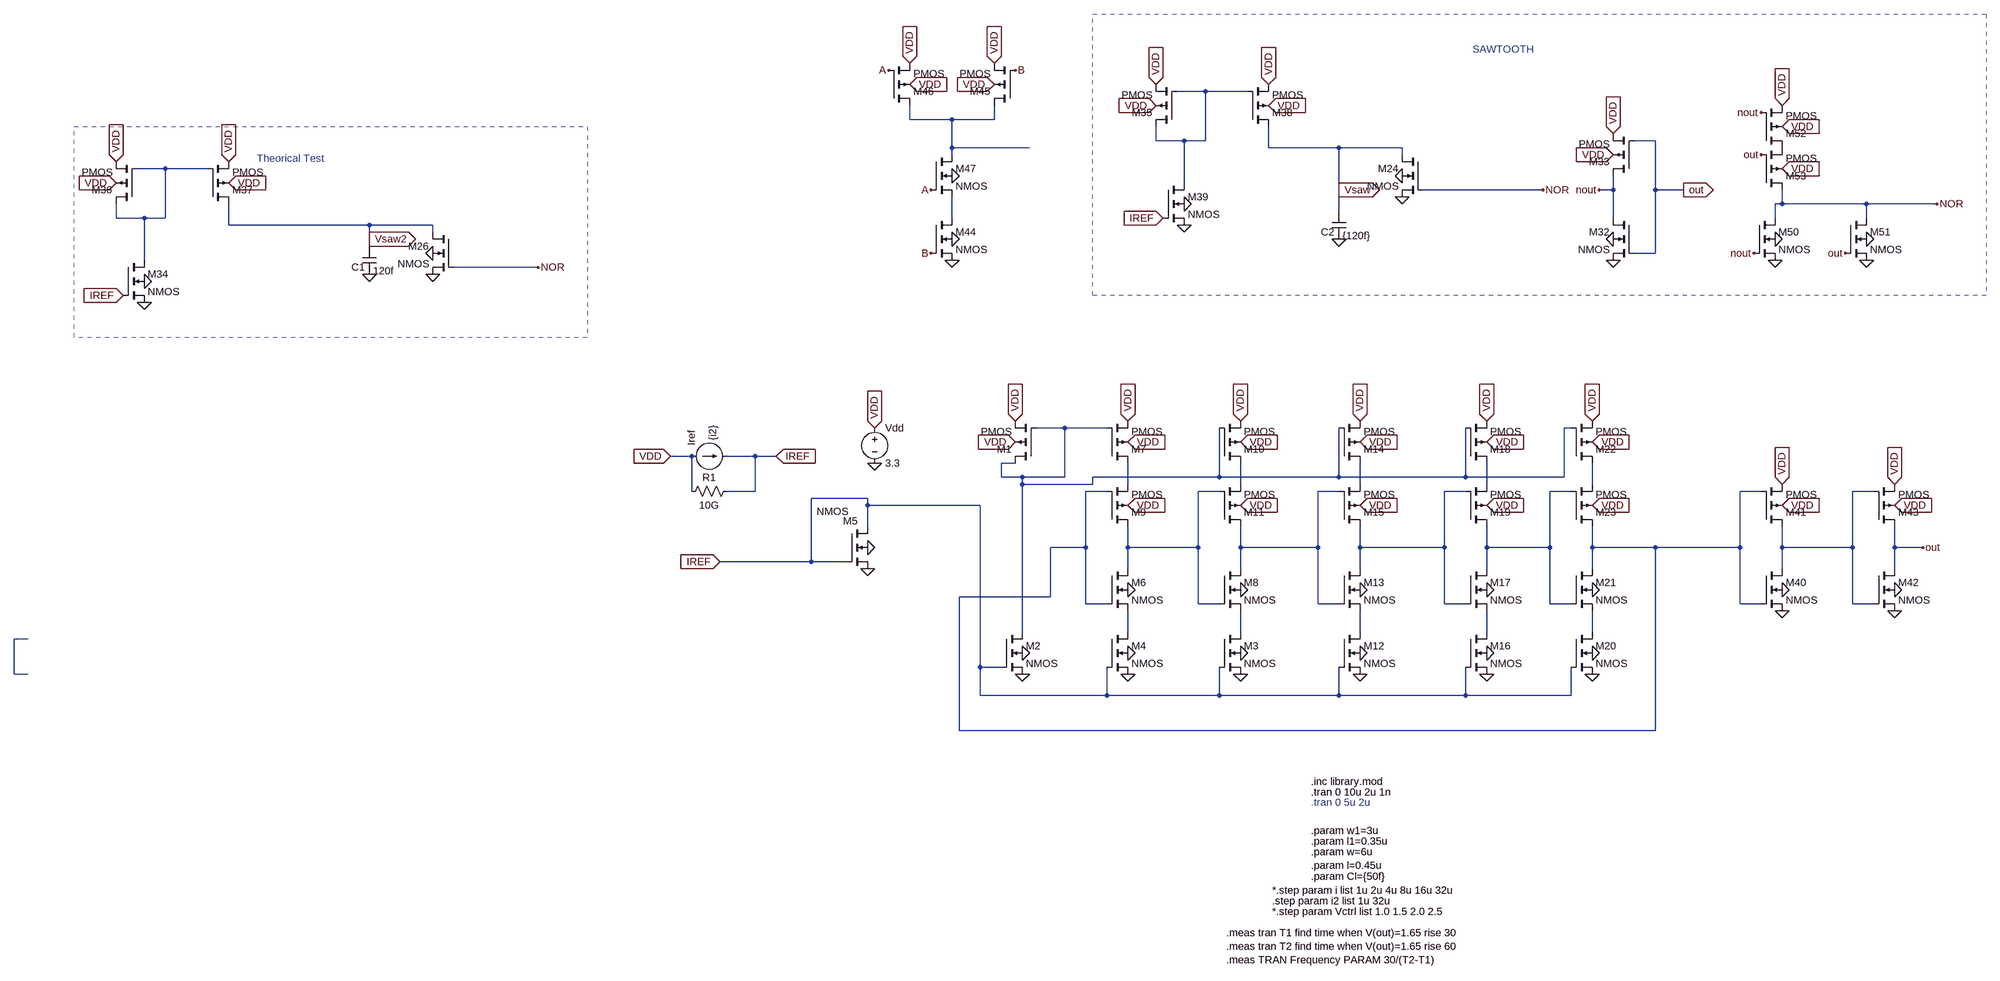
[diagram p0: schematic sawtooth.asc]
sawtooth.asc, the LTspice schematic file:
Version 4
SHEET 1 2660 1612
WIRE 272 -880 208 -880
WIRE 368 -880 272 -880
WIRE -400 -816 -400 -848
WIRE -304 -816 -400 -816
WIRE -208 -816 -208 -848
WIRE -208 -816 -304 -816
WIRE 160 -768 160 -800
WIRE 224 -768 160 -768
WIRE 272 -768 272 -880
WIRE 272 -768 224 -768
WIRE 1296 -768 1248 -768
WIRE -304 -752 -304 -816
WIRE -128 -752 -304 -752
WIRE 416 -752 416 -800
WIRE 576 -752 416 -752
WIRE 720 -752 576 -752
WIRE -304 -736 -304 -752
WIRE 720 -736 720 -752
WIRE -2480 -704 -2544 -704
WIRE -2384 -704 -2480 -704
WIRE 224 -672 224 -768
WIRE 576 -656 576 -752
WIRE 1040 -656 768 -656
WIRE 1200 -656 1200 -688
WIRE 1200 -656 1168 -656
WIRE 1296 -656 1296 -768
WIRE 1360 -656 1296 -656
WIRE 1584 -624 1584 -656
WIRE 1584 -624 1568 -624
WIRE 1776 -624 1584 -624
WIRE 1936 -624 1776 -624
WIRE 576 -608 576 -656
WIRE -2592 -592 -2592 -624
WIRE -2528 -592 -2592 -592
WIRE -2480 -592 -2480 -704
WIRE -2480 -592 -2528 -592
WIRE -304 -592 -304 -640
WIRE 1200 -592 1200 -656
WIRE 1568 -592 1568 -624
WIRE 1776 -592 1776 -624
WIRE -2336 -576 -2336 -624
WIRE -2016 -576 -2336 -576
WIRE -1872 -576 -2016 -576
WIRE -1872 -560 -1872 -576
WIRE -2016 -544 -2016 -576
WIRE -2016 -528 -2016 -544
WIRE 1296 -512 1296 -656
WIRE 1296 -512 1248 -512
WIRE -2528 -496 -2528 -592
WIRE -1632 -480 -1824 -480
WIRE -48 -96 -112 -96
WIRE 48 -96 -48 -96
WIRE 1104 -96 1088 -96
WIRE -896 -32 -944 -32
WIRE -752 -32 -816 -32
WIRE -704 -32 -752 -32
WIRE -160 -16 -192 -16
WIRE -192 16 -192 -16
WIRE -144 16 -192 16
WIRE -48 16 -48 -96
WIRE -48 16 -144 16
WIRE 304 16 304 -96
WIRE 304 16 16 16
WIRE 576 16 576 -96
WIRE 576 16 304 16
WIRE 864 16 864 -96
WIRE 864 16 576 16
WIRE 1088 16 1088 -96
WIRE 1088 16 864 16
WIRE -144 32 -144 16
WIRE 16 32 16 16
WIRE 16 32 -144 32
WIRE 96 32 96 -16
WIRE 352 32 352 -16
WIRE 624 32 624 -16
WIRE 912 32 912 -16
WIRE 1152 32 1152 -16
WIRE -896 48 -896 -32
WIRE -752 48 -752 -32
WIRE -752 48 -816 48
WIRE 48 48 0 48
WIRE 304 48 256 48
WIRE 576 48 528 48
WIRE 864 48 816 48
WIRE 1104 48 1056 48
WIRE 1536 48 1488 48
WIRE 1792 48 1744 48
WIRE -496 64 -624 64
WIRE -496 80 -496 64
WIRE -240 80 -496 80
WIRE -496 128 -496 80
WIRE 0 176 0 48
WIRE 0 176 -80 176
WIRE 96 176 96 128
WIRE 256 176 256 48
WIRE 256 176 96 176
WIRE 352 176 352 128
WIRE 528 176 528 48
WIRE 528 176 352 176
WIRE 624 176 624 128
WIRE 816 176 816 48
WIRE 816 176 624 176
WIRE 912 176 912 128
WIRE 1056 176 1056 48
WIRE 1056 176 912 176
WIRE 1152 176 1152 128
WIRE 1296 176 1152 176
WIRE 1488 176 1488 48
WIRE 1488 176 1296 176
WIRE 1584 176 1584 128
WIRE 1744 176 1744 48
WIRE 1744 176 1584 176
WIRE 1840 176 1840 128
WIRE 1904 176 1840 176
WIRE -624 208 -624 64
WIRE -624 208 -832 208
WIRE -544 208 -624 208
WIRE 96 224 96 176
WIRE 352 224 352 176
WIRE 624 224 624 176
WIRE 912 224 912 176
WIRE 1152 224 1152 176
WIRE 1584 224 1584 176
WIRE 1840 224 1840 176
WIRE -80 288 -80 176
WIRE -80 288 -288 288
WIRE 0 304 0 176
WIRE 48 304 0 304
WIRE 256 304 256 176
WIRE 304 304 256 304
WIRE 528 304 528 176
WIRE 576 304 528 304
WIRE 816 304 816 176
WIRE 864 304 816 304
WIRE 1056 304 1056 176
WIRE 1104 304 1056 304
WIRE 1488 304 1488 176
WIRE 1536 304 1488 304
WIRE 1744 304 1744 176
WIRE 1792 304 1744 304
WIRE -144 368 -144 32
WIRE 96 368 96 320
WIRE 352 368 352 320
WIRE 624 368 624 320
WIRE 912 368 912 320
WIRE 1152 368 1152 320
WIRE -3824 384 -3856 384
WIRE -240 448 -240 80
WIRE -192 448 -240 448
WIRE -3856 464 -3856 384
WIRE -3824 464 -3856 464
WIRE -240 512 -240 448
WIRE 48 512 48 448
WIRE 48 512 -240 512
WIRE 304 512 304 448
WIRE 304 512 48 512
WIRE 576 512 576 448
WIRE 576 512 304 512
WIRE 864 512 864 448
WIRE 864 512 576 512
WIRE 1104 512 1104 448
WIRE 1104 512 864 512
WIRE -288 592 -288 288
WIRE 1296 592 1296 176
WIRE 1296 592 -288 592
FLAG -480 -96 VDD
IOPIN -480 -96 In
FLAG -480 -16 0
FLAG -160 -112 VDD
IOPIN -160 -112 In
FLAG -160 -64 VDD
IOPIN -160 -64 In
FLAG -144 416 0
FLAG -144 464 0
FLAG 96 416 0
FLAG 96 464 0
FLAG -496 176 0
FLAG 96 272 0
FLAG 96 -112 VDD
IOPIN 96 -112 In
FLAG 96 -64 VDD
IOPIN 96 -64 In
FLAG 96 80 VDD
IOPIN 96 80 In
FLAG 352 416 0
FLAG 352 464 0
FLAG 352 272 0
FLAG 352 -112 VDD
IOPIN 352 -112 In
FLAG 352 -64 VDD
IOPIN 352 -64 In
FLAG 352 80 VDD
IOPIN 352 80 In
FLAG 624 416 0
FLAG 624 464 0
FLAG 624 272 0
FLAG 624 -112 VDD
IOPIN 624 -112 In
FLAG 624 -64 VDD
IOPIN 624 -64 In
FLAG 624 80 VDD
IOPIN 624 80 In
FLAG 912 416 0
FLAG 912 464 0
FLAG 912 272 0
FLAG 912 -112 VDD
IOPIN 912 -112 In
FLAG 912 -64 VDD
IOPIN 912 -64 In
FLAG 912 80 VDD
IOPIN 912 80 In
FLAG 1152 416 0
FLAG 1152 464 0
FLAG 1152 272 0
FLAG 1152 -112 VDD
IOPIN 1152 -112 In
FLAG 1152 -64 VDD
IOPIN 1152 -64 In
FLAG 1152 80 VDD
IOPIN 1152 80 In
FLAG -496 224 0
FLAG 576 -544 0
FLAG 720 -688 0
FLAG 720 -640 0
FLAG 576 -656 Vsaw
IOPIN 576 -656 Out
FLAG -2016 -464 0
FLAG -1872 -512 0
FLAG -1872 -464 0
FLAG -2016 -544 Vsaw2
IOPIN -2016 -544 Out
FLAG -832 208 IREF
IOPIN -832 208 In
FLAG -704 -32 IREF
IOPIN -704 -32 In
FLAG 1200 -544 0
FLAG 1200 -736 VDD
IOPIN 1200 -736 In
FLAG 1200 -784 VDD
IOPIN 1200 -784 In
FLAG 1200 -496 0
FLAG -2592 -720 VDD
IOPIN -2592 -720 In
FLAG -2592 -672 VDD
IOPIN -2592 -672 In
FLAG -2336 -720 VDD
IOPIN -2336 -720 In
FLAG -2336 -672 VDD
IOPIN -2336 -672 In
FLAG -2528 -448 0
FLAG -2528 -400 0
FLAG -2576 -416 IREF
IOPIN -2576 -416 In
FLAG 160 -896 VDD
IOPIN 160 -896 In
FLAG 160 -848 VDD
IOPIN 160 -848 In
FLAG 416 -896 VDD
IOPIN 416 -896 In
FLAG 416 -848 VDD
IOPIN 416 -848 In
FLAG 224 -624 0
FLAG 224 -576 0
FLAG 176 -592 IREF
IOPIN 176 -592 In
FLAG 1360 -656 out
IOPIN 1360 -656 Out
FLAG 1584 272 0
FLAG 1584 80 VDD
IOPIN 1584 80 In
FLAG 1584 32 VDD
IOPIN 1584 32 In
FLAG 1584 320 0
FLAG 1840 272 0
FLAG 1840 80 VDD
IOPIN 1840 80 In
FLAG 1840 32 VDD
IOPIN 1840 32 In
FLAG 1840 320 0
FLAG 1904 176 out
FLAG -944 -32 VDD
IOPIN -944 -32 In
FLAG -208 -944 VDD
IOPIN -208 -944 In
FLAG -208 -896 VDD
IOPIN -208 -896 In
FLAG -304 -544 0
FLAG -304 -496 0
FLAG -400 -944 VDD
IOPIN -400 -944 In
FLAG -400 -896 VDD
IOPIN -400 -896 In
FLAG -304 -688 0
FLAG -160 -928 B
FLAG -352 -512 B
FLAG -352 -656 A
FLAG 1568 -544 0
FLAG 1568 -496 0
FLAG 1776 -544 0
FLAG 1776 -496 0
FLAG 1584 -848 VDD
IOPIN 1584 -848 In
FLAG 1584 -800 VDD
IOPIN 1584 -800 In
FLAG 1584 -704 VDD
IOPIN 1584 -704 In
FLAG 1536 -832 nout
FLAG 1520 -512 nout
FLAG 1936 -624 NOR
FLAG 1536 -736 out
FLAG 1728 -512 out
FLAG 1168 -656 nout
FLAG 1040 -656 NOR
FLAG -448 -928 A
FLAG -1632 -480 NOR
SYMBOL pmos4 -112 -16 R180
SYMATTR InstName M1
SYMATTR Value2 l=l1 w=w1
SYMBOL voltage -480 -112 R0
SYMATTR InstName Vdd
SYMATTR Value 3.3
SYMBOL current -896 -32 R270
WINDOW 3 35 48 Left 2
WINDOW 123 0 0 Left 0
WINDOW 39 0 0 Left 0
SYMATTR Value {i2}
SYMATTR InstName Iref
SYMBOL nmos4 -192 368 R0
SYMATTR InstName M2
SYMATTR Value2 l=l1 w=w1
SYMBOL res -800 32 R90
WINDOW 0 0 56 VBottom 2
WINDOW 3 32 56 VTop 2
SYMATTR InstName R1
SYMATTR Value 10G
SYMBOL nmos4 48 368 R0
SYMATTR InstName M4
SYMATTR Value2 l=l w=w
SYMBOL nmos4 -544 128 R0
WINDOW 0 -8 -12 Left 2
WINDOW 3 -68 -34 Left 2
SYMATTR InstName M5
SYMATTR Value2 l=0.35u w=3u
SYMBOL nmos4 48 224 R0
SYMATTR InstName M6
SYMATTR Value2 l=l w=w
SYMBOL pmos4 48 -16 M180
SYMATTR InstName M7
SYMATTR Value2 l=l w=w
SYMBOL pmos4 48 128 M180
SYMATTR InstName M9
SYMATTR Value2 l=l w=w
SYMBOL nmos4 304 368 R0
SYMATTR InstName M3
SYMATTR Value2 l=l w=w
SYMBOL nmos4 304 224 R0
SYMATTR InstName M8
SYMATTR Value2 l=l w=w
SYMBOL pmos4 304 -16 M180
SYMATTR InstName M10
SYMATTR Value2 l=l w=w
SYMBOL pmos4 304 128 M180
SYMATTR InstName M11
SYMATTR Value2 l=l w=w
SYMBOL nmos4 576 368 R0
SYMATTR InstName M12
SYMATTR Value2 l=l w=w
SYMBOL nmos4 576 224 R0
SYMATTR InstName M13
SYMATTR Value2 l=l w=w
SYMBOL pmos4 576 -16 M180
SYMATTR InstName M14
SYMATTR Value2 l=l w=w
SYMBOL pmos4 576 128 M180
SYMATTR InstName M15
SYMATTR Value2 l=l w=w
SYMBOL nmos4 864 368 R0
SYMATTR InstName M16
SYMATTR Value2 l=l w=w
SYMBOL nmos4 864 224 R0
SYMATTR InstName M17
SYMATTR Value2 l=l w=w
SYMBOL pmos4 864 -16 M180
SYMATTR InstName M18
SYMATTR Value2 l=l w=w
SYMBOL pmos4 864 128 M180
SYMATTR InstName M19
SYMATTR Value2 l=l w=w
SYMBOL nmos4 1104 368 R0
SYMATTR InstName M20
SYMATTR Value2 l=l w=w
SYMBOL nmos4 1104 224 R0
SYMATTR InstName M21
SYMATTR Value2 l=l w=w
SYMBOL pmos4 1104 -16 M180
SYMATTR InstName M22
SYMATTR Value2 l=l w=w
SYMBOL pmos4 1104 128 M180
SYMATTR InstName M23
SYMATTR Value2 l=l w=w
SYMBOL cap 560 -608 R0
WINDOW 0 -25 48 Left 2
SYMATTR InstName C2
SYMATTR Value {120f}
SYMBOL nmos4 768 -736 M0
SYMATTR InstName M24
SYMATTR Value2 l=0.35u w=4u
SYMBOL cap -2032 -528 R0
WINDOW 0 -25 48 Left 2
SYMATTR InstName C1
SYMATTR Value 120f
SYMBOL nmos4 -1824 -560 M0
SYMATTR InstName M26
SYMATTR Value2 l=0.35u w=2u
SYMBOL nmos4 1248 -592 M0
SYMATTR InstName M32
SYMATTR Value2 l=l w=w
SYMBOL pmos4 1248 -688 R180
SYMATTR InstName M33
SYMATTR Value2 l=l w=w
SYMBOL pmos4 -2544 -624 R180
SYMATTR InstName M36
SYMATTR Value2 l=0.35u w={2u}
SYMBOL pmos4 -2384 -624 M180
SYMATTR InstName M37
SYMATTR Value2 l=0.35u w={1u}
SYMBOL nmos4 -2576 -496 R0
SYMATTR InstName M34
SYMATTR Value2 l=0.35u w=2u
SYMBOL pmos4 208 -800 R180
SYMATTR InstName M35
SYMATTR Value2 l=0.35u w={1u}
SYMBOL pmos4 368 -800 M180
SYMATTR InstName M38
SYMATTR Value2 l=0.75u w={2u}
SYMBOL nmos4 176 -672 R0
SYMATTR InstName M39
SYMATTR Value2 l=0.35u w=2u
SYMBOL nmos4 1536 224 R0
SYMATTR InstName M40
SYMATTR Value2 l=l w=w
SYMBOL pmos4 1536 128 M180
SYMATTR InstName M41
SYMATTR Value2 l=l w=w
SYMBOL nmos4 1792 224 R0
SYMATTR InstName M42
SYMATTR Value2 l=l w=w
SYMBOL pmos4 1792 128 M180
SYMATTR InstName M43
SYMATTR Value2 l=l w=w
SYMBOL pmos4 -160 -848 R180
SYMATTR InstName M45
SYMATTR Value2 l=0.35u w=0.4u
SYMBOL nmos4 -352 -592 R0
SYMATTR InstName M44
SYMATTR Value2 l=0.35u w=2u
SYMBOL pmos4 -448 -848 M180
SYMATTR InstName M46
SYMATTR Value2 l=0.35u w=1u
SYMBOL nmos4 -352 -736 R0
SYMATTR InstName M47
SYMATTR Value2 l=0.35u w=20u
SYMBOL nmos4 1520 -592 R0
SYMATTR InstName M50
SYMATTR Value2 l=0.35u w=0.4u
SYMBOL nmos4 1728 -592 R0
SYMATTR InstName M51
SYMATTR Value2 l=0.35u w=2u
SYMBOL pmos4 1536 -752 M180
SYMATTR InstName M52
SYMATTR Value2 l=0.35u w=50u
SYMBOL pmos4 1536 -656 M180
SYMATTR InstName M53
SYMATTR Value2 l=0.35u w=10u
TEXT 512 808 Left 2 !.inc library.mod
TEXT 512 968 Left 2 !.param w=6u\n.param l=0.45u
TEXT 512 856 Left 2 ;.tran 0 5u 2u
TEXT 320 1152 Left 2 !.meas tran T1 find time when V(out)=1.65 rise 30\n.meas tran T2 find time when V(out)=1.65 rise 60\n.meas TRAN Frequency PARAM 30/(T2-T1)
TEXT 424 1056 Left 2 !*.step param i list 1u 2u 4u 8u 16u 32u
TEXT 512 1024 Left 2 !.param Cl={50f}
TEXT 512 920 Left 2 !.param w1=3u
TEXT 512 944 Left 2 !.param l1=0.35u
TEXT 512 832 Left 2 !.tran 0 10u 2u 1n
TEXT 424 1080 Left 2 !.step param i2 list 1u 32u
TEXT -2272 -728 Left 2 ;Theorical Test
TEXT 424 1104 Left 2 !*.step param Vctrl list 1.0 1.5 2.0 2.5
TEXT 880 -976 Left 2 ;SAWTOOTH
RECTANGLE Normal -2688 -800 -1520 -320 2
RECTANGLE Normal 2048 -416 16 -1056 2

The netlist it stands for:
* sawtooth.asc
M1 N005 N005 VDD VDD PMOS l=l1 w=w1
Vdd VDD 0 3.3
Iref VDD IREF {i2}
M2 N005 IREF 0 0 NMOS l=l1 w=w1
R1 IREF VDD 10G
M4 N017 IREF 0 0 NMOS l=l w=w
M5 IREF IREF 0 0 NMOS l=0.35u w=3u
M6 N012 N011 N017 0 NMOS l=l w=w
M7 N006 N005 VDD VDD PMOS l=l w=w
M9 N012 N011 N006 VDD PMOS l=l w=w
M3 N018 IREF 0 0 NMOS l=l w=w
M8 N013 N012 N018 0 NMOS l=l w=w
M10 N007 N005 VDD VDD PMOS l=l w=w
M11 N013 N012 N007 VDD PMOS l=l w=w
M12 N019 IREF 0 0 NMOS l=l w=w
M13 N014 N013 N019 0 NMOS l=l w=w
M14 N008 N005 VDD VDD PMOS l=l w=w
M15 N014 N013 N008 VDD PMOS l=l w=w
M16 N020 IREF 0 0 NMOS l=l w=w
M17 N015 N014 N020 0 NMOS l=l w=w
M18 N009 N005 VDD VDD PMOS l=l w=w
M19 N015 N014 N009 VDD PMOS l=l w=w
M20 N021 IREF 0 0 NMOS l=l w=w
M21 N011 N015 N021 0 NMOS l=l w=w
M22 N010 N005 VDD VDD PMOS l=l w=w
M23 N011 N015 N010 VDD PMOS l=l w=w
C2 Vsaw 0 {120f}
M24 Vsaw NOR 0 0 NMOS l=0.35u w=4u
C1 Vsaw2 0 120f
M26 Vsaw2 NOR 0 0 NMOS l=0.35u w=2u
M32 nout out 0 0 NMOS l=l w=w
M33 nout out VDD VDD PMOS l=l w=w
M36 N003 N003 VDD VDD PMOS l=0.35u w={2u}
M37 Vsaw2 N003 VDD VDD PMOS l=0.35u w={1u}
M34 N003 IREF 0 0 NMOS l=0.35u w=2u
M35 N001 N001 VDD VDD PMOS l=0.35u w={1u}
M38 Vsaw N001 VDD VDD PMOS l=0.75u w={2u}
M39 N001 IREF 0 0 NMOS l=0.35u w=2u
M40 N016 N011 0 0 NMOS l=l w=w
M41 N016 N011 VDD VDD PMOS l=l w=w
M42 out N016 0 0 NMOS l=l w=w
M43 out N016 VDD VDD PMOS l=l w=w
M45 N002 B VDD VDD PMOS l=0.35u w=0.4u
M44 N004 B 0 0 NMOS l=0.35u w=2u
M46 N002 A VDD VDD PMOS l=0.35u w=1u
M47 N002 A N004 0 NMOS l=0.35u w=20u
M50 NOR nout 0 0 NMOS l=0.35u w=0.4u
M51 NOR out 0 0 NMOS l=0.35u w=2u
M52 P001 nout VDD VDD PMOS l=0.35u w=50u
M53 NOR out P001 VDD PMOS l=0.35u w=10u
.model NMOS NMOS
.model PMOS PMOS
.lib standard.mos
.inc library.mod
.param w=6u
.param l=0.45u
* .tran 0 5u 2u
.meas tran T1 find time when V(out)=1.65 rise 30
.meas tran T2 find time when V(out)=1.65 rise 60
.meas TRAN Frequency PARAM 30/(T2-T1)
*.step param i list 1u 2u 4u 8u 16u 32u
.param Cl={50f}
.param w1=3u
.param l1=0.35u
.tran 0 10u 2u 1n
.step param i2 list 1u 32u
* Theorical Test
*.step param Vctrl list 1.0 1.5 2.0 2.5
* SAWTOOTH
.backanno
.end